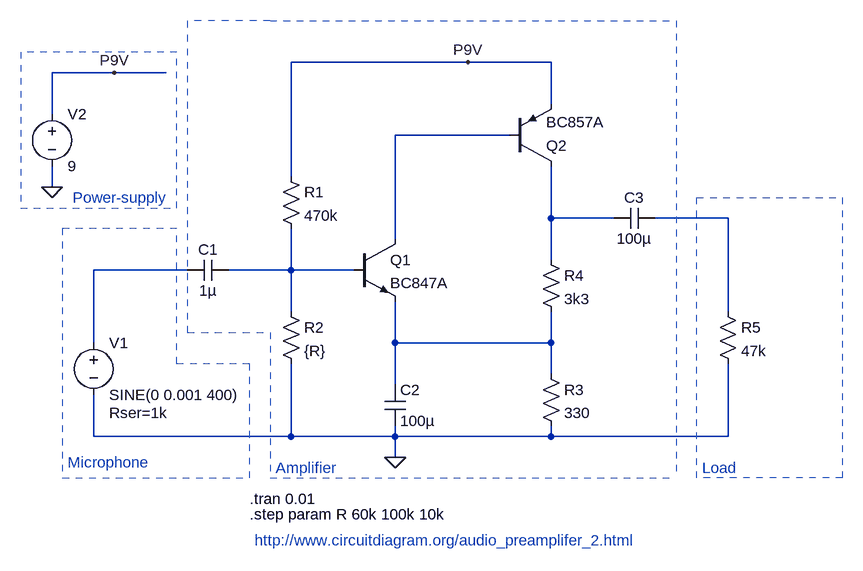
[diagram p0: schematic mic_preamp.asc]
mic_preamp.asc, the LTspice schematic file:
Version 4
SHEET 1 880 680
WIRE 272 -160 0 -160
WIRE 400 -160 272 -160
WIRE -272 -144 -368 -144
WIRE -192 -144 -272 -144
WIRE 400 -96 400 -160
WIRE -368 -80 -368 -144
WIRE 336 -48 160 -48
WIRE 0 16 0 -160
WIRE -368 32 -368 0
WIRE 400 80 400 0
WIRE 496 80 400 80
WIRE 672 80 560 80
WIRE 160 112 160 -48
WIRE 400 144 400 80
WIRE -160 160 -304 160
WIRE 0 160 0 96
WIRE 0 160 -96 160
WIRE 96 160 0 160
WIRE 0 224 0 160
WIRE 672 224 672 80
WIRE -304 272 -304 160
WIRE 160 272 160 208
WIRE 400 272 400 224
WIRE 400 272 160 272
WIRE 400 320 400 272
WIRE 160 336 160 272
WIRE -304 416 -304 352
WIRE 0 416 0 304
WIRE 0 416 -304 416
WIRE 160 416 160 400
WIRE 160 416 0 416
WIRE 400 416 400 400
WIRE 400 416 160 416
WIRE 672 416 672 304
WIRE 672 416 400 416
WIRE 160 448 160 416
FLAG 160 448 0
FLAG -368 32 0
FLAG -272 -144 P9V
FLAG 272 -160 P9V
SYMBOL npn 96 112 R0
SYMATTR InstName Q1
SYMATTR Value BC847A
SYMBOL pnp 336 0 M180
SYMATTR InstName Q2
SYMATTR Value BC857A
SYMBOL res -16 0 R0
SYMATTR InstName R1
SYMATTR Value 470k
SYMBOL res -16 208 R0
SYMATTR InstName R2
SYMATTR Value {R}
SYMBOL cap -96 144 R90
WINDOW 0 0 32 VBottom 2
WINDOW 3 32 32 VTop 2
SYMATTR InstName C1
SYMATTR Value 1µ
SYMBOL cap 144 336 R0
SYMATTR InstName C2
SYMATTR Value 100µ
SYMBOL res 384 304 R0
SYMATTR InstName R3
SYMATTR Value 330
SYMBOL res 384 128 R0
SYMATTR InstName R4
SYMATTR Value 3k3
SYMBOL cap 560 64 R90
WINDOW 0 0 32 VBottom 2
WINDOW 3 32 32 VTop 2
SYMATTR InstName C3
SYMATTR Value 100µ
SYMBOL res 656 208 R0
SYMATTR InstName R5
SYMATTR Value 47k
SYMBOL voltage -304 256 R0
WINDOW 123 0 0 Left 0
WINDOW 39 24 124 Left 2
SYMATTR SpiceLine Rser=1k
SYMATTR InstName V1
SYMATTR Value SINE(0 0.001 400)
SYMBOL voltage -368 -96 R0
WINDOW 123 0 0 Left 0
WINDOW 39 0 0 Left 0
SYMATTR InstName V2
SYMATTR Value 9
TEXT -64 512 Left 2 !.tran 0.01
TEXT -64 536 Left 2 !.step param R 60k 100k 10k
TEXT -56 576 Left 2 ;http://www.circuitdiagram.org/audio_preamplifer_2.html
TEXT -336 48 Left 2 ;Power-supply
TEXT -344 456 Left 2 ;Microphone
TEXT -24 464 Left 2 ;Amplifier
TEXT 632 464 Left 2 ;Load
LINE Normal 624 480 624 48 2
LINE Normal 848 480 624 480 2
LINE Normal 848 48 848 480 2
LINE Normal 624 48 848 48 2
LINE Normal -32 480 592 480 2
LINE Normal 592 -224 592 480 2
LINE Normal -32 -224 592 -224 2
LINE Normal -32 -224 -32 -224 2
LINE Normal -352 480 -64 480 2
LINE Normal -352 96 -352 480 2
LINE Normal -64 480 -64 304 2
LINE Normal -32 256 -32 480 2
LINE Normal -160 256 -32 256 2
LINE Normal -160 -160 -160 256 2
LINE Normal -160 -224 -160 -160 2
LINE Normal -32 -224 -160 -224 2
LINE Normal -176 96 -352 96 2
LINE Normal -176 304 -176 96 2
LINE Normal -64 304 -176 304 2
LINE Normal -176 -176 -416 -176 2
LINE Normal -176 64 -176 -176 2
LINE Normal -416 64 -176 64 2
LINE Normal -416 -176 -416 64 2

The netlist it stands for:
* mic_preamp.asc
Q1 N001 N005 N006 0 BC847A
Q2 N002 N001 P9V 0 BC857A
R1 P9V N005 470k
R2 N005 0 {R}
C1 N005 N004 1µ
C2 N006 0 100µ
R3 N006 0 330
R4 N002 N006 3k3
C3 N003 N002 100µ
R5 N003 0 47k
V1 N004 0 SINE(0 0.001 400) Rser=1k
V2 P9V 0 9
.model NPN NPN
.model PNP PNP
.lib standard.bjt
.tran 0.01
.step param R 60k 100k 10k
* http://www.circuitdiagram.org/audio_preamplifer_2.html
* Power-supply
* Microphone
* Amplifier
* Load
.backanno
.end